# EAGLE design KIT_UNAZ (EAGLE 9.4.1)
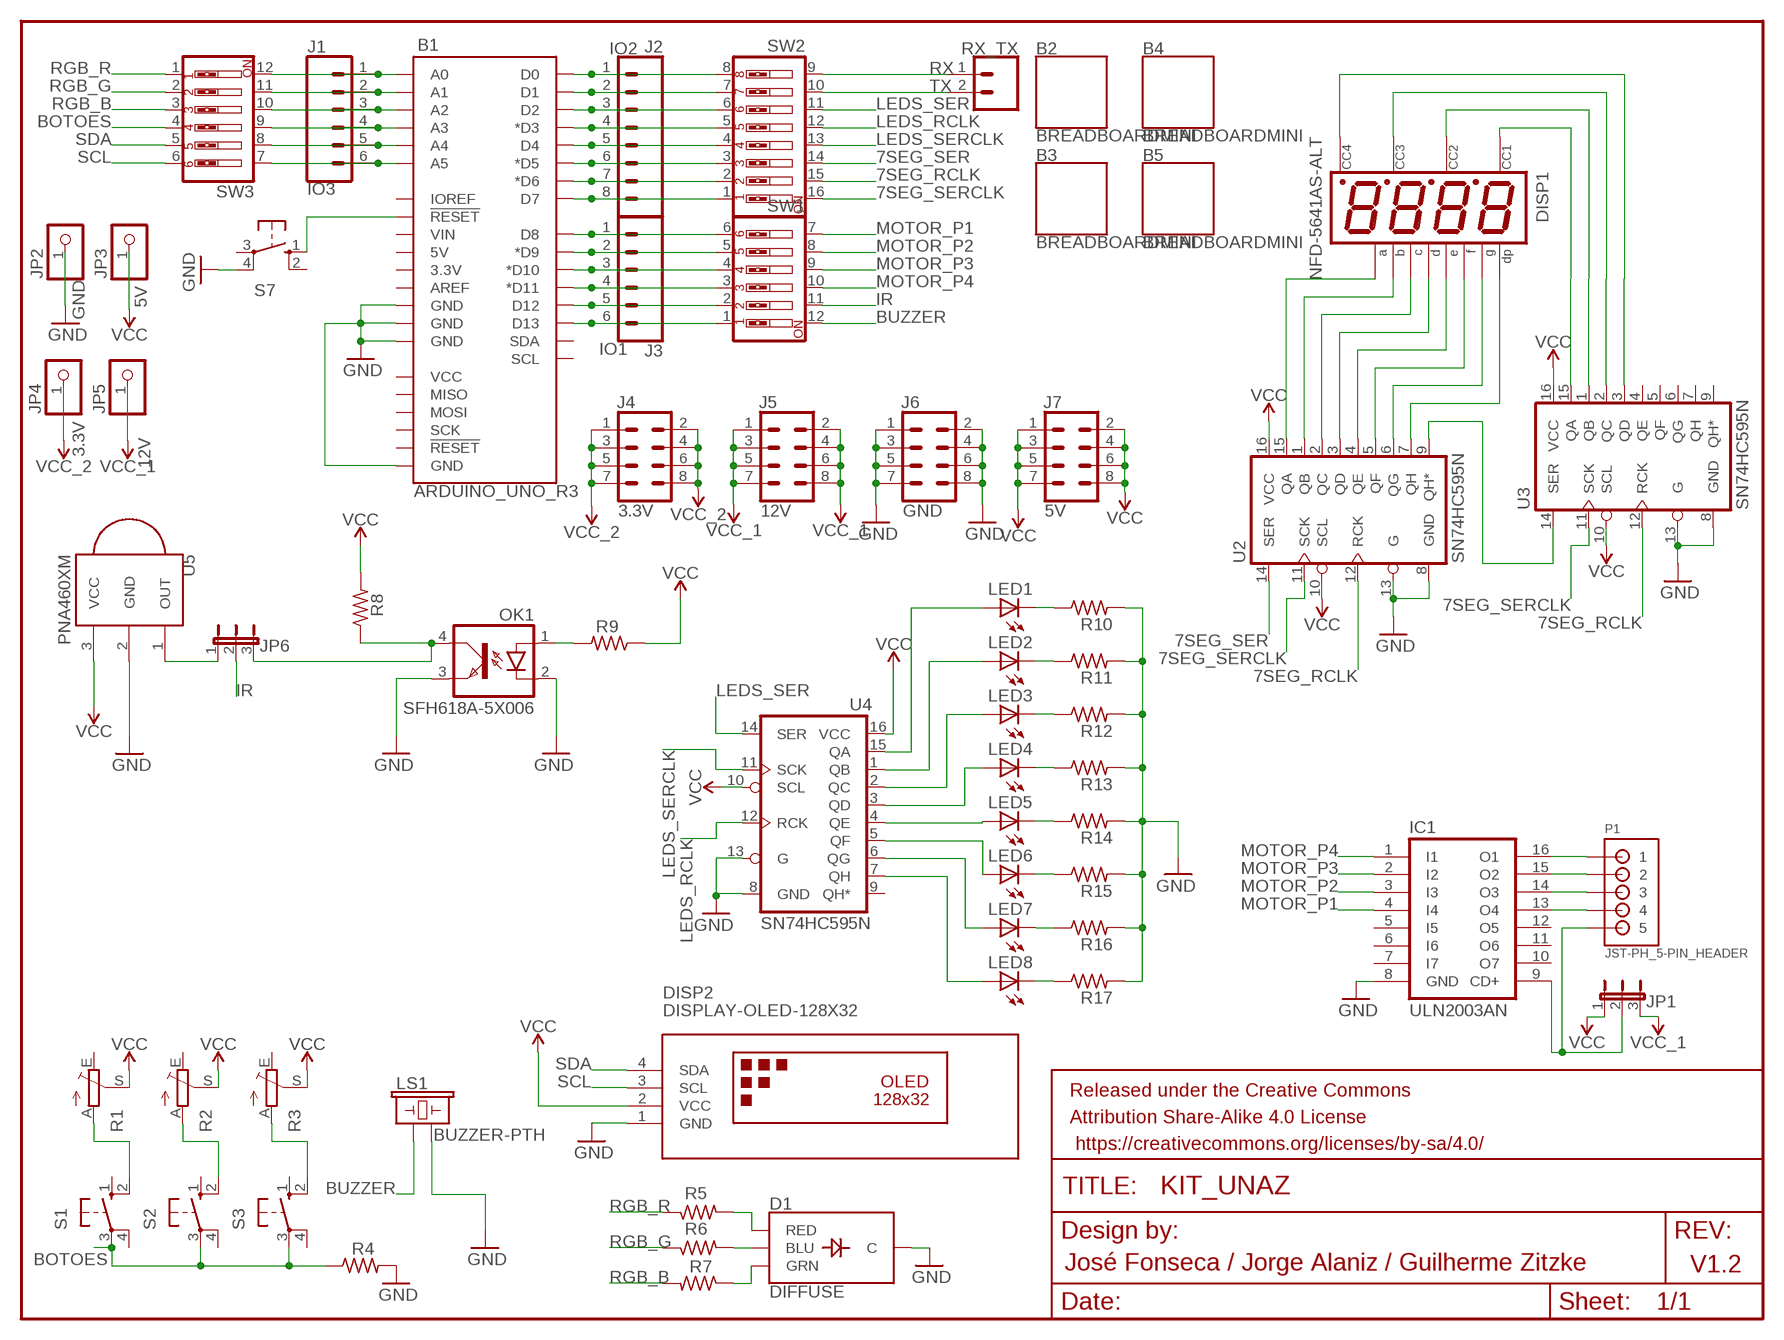
[diagram p0: schematic, sheet 1]

## Parts
B1  ARDUINO_UNO_R3  [ARDUINO_R3]
B2  BREADBOARDMINI  [BREADBOARD-MINI]
B3  BREADBOARDMINI  [BREADBOARD-MINI]
B4  BREADBOARDMINI  [BREADBOARD-MINI]
B5  BREADBOARDMINI  [BREADBOARD-MINI]
D1  DIFFUSE  LED-RGB-CCDIFFUSE  [WS2812B-PTH-KIT]
DISP1  NFD-5641AS-ALT  [NFD-5641]
DISP2  DISPLAY-OLED-128X32  [DISPLAY-OLED-128X32]
FRAME1  FRAME-LETTER  [CREATIVE_COMMONS]
IC1  ULN2003AN  [DIL16]
J1  IO3  CONN_06SILK_FEMALE_PTH  [1X06]
J2  IO2  CONN_08"  [1X08]
J3  IO1  CONN_06SILK_FEMALE_PTH  [1X06]
J4  3.3V  CONN_04X2  [2X4]
J5  12V  CONN_04X2  [2X4]
J6  GND  CONN_04X2  [2X4]
J7  5V  CONN_04X2  [2X4]
JP1  JP2E  [JP2]
JP2  GND  PINHD-1X1  [1X01]
JP3  5V  PINHD-1X1  [1X01]
JP4  3.3V  PINHD-1X1  [1X01]
JP5  12V  PINHD-1X1  [1X01]
JP6  JP2E  [JP2]
LED1  LED5MM  [LED5MM]
LED2  LED5MM  [LED5MM]
LED3  LED5MM  [LED5MM]
LED4  LED5MM  [LED5MM]
LED5  LED5MM  [LED5MM]
LED6  LED5MM  [LED5MM]
LED7  LED5MM  [LED5MM]
LED8  LED5MM  [LED5MM]
LS1  BUZZER-PTH  [BUZZER-12MM]
OK1  SFH618A-5X006  [DIP4-400]
P1  JST-PH_5-PIN_HEADER  [JST_B5B-PH_HEADER]
R1  TRIM_EU-B64Y  [B64Y]
R2  TRIM_EU-B64Y  [B64Y]
R3  TRIM_EU-B64Y  [B64Y]
R4  R-US_0204/7  [0204/7]
R5  R-US_0204/7  [0204/7]
R6  R-US_0204/7  [0204/7]
R7  R-US_0204/7  [0204/7]
R8  R-US_0204/7  [0204/7]
R9  R-US_0204/7  [0204/7]
R10  R-US_0204/7  [0204/7]
R11  R-US_0204/7  [0204/7]
R12  R-US_0204/7  [0204/7]
R13  R-US_0204/7  [0204/7]
R14  R-US_0204/7  [0204/7]
R15  R-US_0204/7  [0204/7]
R16  R-US_0204/7  [0204/7]
R17  R-US_0204/7  [0204/7]
RX_TX  CONN_02  [1X02]
S1  40-XX  [B3F-40XX]
S2  40-XX  [B3F-40XX]
S3  40-XX  [B3F-40XX]
S7  40-XX  [B3F-40XX]
SW1  SW_DIP-6  [EDG-06]
SW2  SW_DIP-8  [EDG-08]
SW3  SW_DIP-6  [EDG-06]
U2  SN74HC595N  74HC595N  [DIP16]
U3  SN74HC595N  74HC595N  [DIP16]
U4  SN74HC595N  74HC595N  [DIP16]
U5  PNA460XM  [PNA460XM]

## Nets
7SEG_RCLK: SW2.15 U2.12(RCK) U3.12(RCK)
7SEG_SER: SW2.14 U2.14(SER)
7SEG_SERCLK: SW2.16 U2.11(SCK) U3.11(SCK)
BOTOES: R4.1 S1.3(P) S2.3(P) S3.3(P) SW3.4
BUZZER: LS1.+ SW1.12
GND: B1.GND@1(GND) B1.GND@2(GND) B1.GND@3(GND) B1.GND@4(GND) D1.2(C) DISP2.1(GND) IC1.8(GND) J6.1 J6.2 J6.3 J6.4 J6.5 J6.6 J6.7 J6.8 JP2.1 LS1.- OK1.2(C) OK1.3(EMIT) R4.2 R10.2 R11.2 R12.2 R13.2 R14.2 R15.2 R16.2 R17.2 S7.4(P1) U2.8(GND) U2.13(G) U3.8(GND) U3.13(G) U4.8(GND) U4.13(G) U5.2(GND)
IR: JP6.2 SW1.11
LEDS_RCLK: SW2.12 U4.12(RCK)
LEDS_SER: SW2.11 U4.14(SER)
LEDS_SERCLK: SW2.13 U4.11(SCK)
MOTOR_P1: IC1.4(I4) SW1.7
MOTOR_P2: IC1.3(I3) SW1.8
MOTOR_P3: IC1.2(I2) SW1.9
MOTOR_P4: IC1.1(I1) SW1.10
N$1: R1.A S1.2(S1)
N$2: R2.A S2.2(S1)
N$3: R3.A S3.2(S1)
N$5: B1.A0 J1.1 SW3.12
N$6: B1.A1 J1.2 SW3.11
N$7: B1.A2 J1.3 SW3.10
N$8: B1.A3 J1.4 SW3.9
N$9: B1.A4 J1.5 SW3.8
N$10: B1.A5 J1.6 SW3.7
N$11: D1.1(RED) R5.2
N$12: D1.4(BLU) R6.2
N$13: D1.3(GRN) R7.1
N$14: DISP1.P$11 U2.15(QA)
N$15: B1.D13 J3.6 SW1.1
N$16: B1.D12 J3.5 SW1.2
N$17: LED5.K(C) R14.1
N$18: LED4.K(C) R13.1
N$19: LED1.K(C) R10.1
N$20: LED2.K(C) R11.1
N$21: LED3.K(C) R12.1
N$22: LED6.K(C) R15.1
N$23: LED1.A U4.15(QA)
N$24: LED2.A U4.1(QB)
N$25: LED3.A U4.2(QC)
N$26: LED4.A U4.3(QD)
N$27: LED5.A U4.4(QE)
N$28: LED6.A U4.5(QF)
N$29: DISP1.P$7 U2.1(QB)
N$30: DISP1.P$4 U2.2(QC)
N$31: DISP1.P$2 U2.3(QD)
N$32: DISP1.P$1 U2.4(QE)
N$33: DISP1.P$10 U2.5(QF)
N$34: DISP1.P$5 U2.6(QG)
N$35: DISP1.P$3 U2.7(QH)
N$36: U2.9(QH*) U3.14(SER)
N$37: LED7.A U4.6(QG)
N$38: LED8.A U4.7(QH)
N$39: B1.D11(*D11) J3.4 SW1.3
N$40: B1.D10(*D10) J3.3 SW1.4
N$41: B1.D9(*D9) J3.2 SW1.5
N$42: DISP1.P$12 U3.15(QA)
N$43: B1.RESET@1(!RESET!) S7.1(S)
N$44: DISP1.P$9 U3.1(QB)
N$45: DISP1.P$8 U3.2(QC)
N$46: DISP1.P$6 U3.3(QD)
N$47: IC1.16(O1) P1.P1
N$48: IC1.15(O2) P1.P2
N$49: IC1.14(O3) P1.P3
N$50: IC1.13(O4) P1.P4
N$51: IC1.9(CD+) JP1.2 P1.P5
N$52: JP6.1 U5.1(OUT)
N$53: JP6.3 OK1.4(COL) R8.1
N$54: OK1.1(A) R9.2
N$55: LED7.K(C) R16.1
N$56: LED8.K(C) R17.1
N$57: B1.D0 J2.1 SW2.8
N$58: B1.D1 J2.2 SW2.7
N$59: B1.D2 J2.3 SW2.6
N$60: B1.D3(*D3) J2.4 SW2.5
N$61: B1.D4 J2.5 SW2.4
N$62: B1.D5(*D5) J2.6 SW2.3
N$63: B1.D6(*D6) J2.7 SW2.2
N$64: B1.D8 J3.1 SW1.6
N$65: B1.D7 J2.8 SW2.1
RGB_B: R7.2 SW3.2
RGB_G: R6.1 SW3.3
RGB_R: R5.1 SW3.1
RX: RX_TX.1 SW2.9
SCL: DISP2.3(SCL) SW3.6
SDA: DISP2.4(SDA) SW3.5
TX: RX_TX.2 SW2.10
VCC: DISP2.2(VCC) J7.1 J7.2 J7.3 J7.4 J7.5 J7.6 J7.7 J7.8 JP1.1 JP3.1 R1.S R2.S R3.S R8.2 R9.1 U2.10(SCL) U2.16(VCC) U3.10(SCL) U3.16(VCC) U4.10(SCL) U4.16(VCC) U5.3(VCC)
VCC_1: J5.1 J5.2 J5.3 J5.4 J5.5 J5.6 J5.7 J5.8 JP1.3 JP5.1
VCC_2: J4.1 J4.2 J4.3 J4.4 J4.5 J4.6 J4.7 J4.8 JP4.1
Unconnected: B1.3.3V B1.5V B1.AREF B1.IOREF B1.MISO B1.MOSI B1.RESET@2(!RESET!) B1.SCK B1.SCL B1.SDA B1.VCC B1.VIN IC1.5(I5) IC1.6(I6) IC1.7(I7) IC1.10(O7) IC1.11(O6) IC1.12(O5) R1.E R2.E R3.E S1.1(S) S1.4(P1) S2.1(S) S2.4(P1) S3.1(S) S3.4(P1) S7.2(S1) S7.3(P) U3.4(QE) U3.5(QF) U3.6(QG) U3.7(QH) U3.9(QH*) U4.9(QH*)

## Notes on the sheet
- José Fonseca / Jorge Alaniz / Guilherme Zitzke | V1.2

## Library data of the parts
B1 = SparkFun-Boards:ARDUINO_UNO_R3: Arduino R3 Footprint with SPI header Arduino Uno R3 Compatible Footprint. Matches PCB size of the original board. SparkFun Products: SAMD21 Dev Breakout <https://www.sparkfun.com/products/13672> RedBoard <https://www.sparkfun.com/products/12757> R3 Stackable Headers <https://www.sparkfun.com/products/11417>
B2-B5 = SparkFun-Boards:BREADBOARD: SparkFun Breadboard Mini This is the mechnical outline for the very small self adhesive breadboard from SparkFun Electronics and our prototyping breadboard of the same size. Good for very small proto areas. SparkFun Products: White <https://www.sparkfun.com/products/7916> Green <https://www.sparkfun.com/products/12046> Black <https://www.sparkfun.com/products/12047> Red <https://www.sparkfun.com/products/12044> Blue <https://www.sparkfun.com/products/12045> SparkFun Solder-able Breadboard-Mini <https://www.sparkfun.com/products/12702>; PROD_ID: COMP-12034
D1 = SparkFun-LED:LED-RGB-CC: LED-RGB Common Cathode Packages: LED RGB-THRU LED_PIRANHA_5MM SparkFun Products: RGB Diffused Common Cathode- Diffuse <[https://www.sparkfun.com/products/9264]> RGB Diffused Common Cathode - Clear <[https://www.sparkfun.com/products/105]> LED-RGB 5mm Square (Piranha) <[https://www.sparkfun.com/products/11679]>; PROD_ID: DIO-09434
DISP1 = display-nfd:NFD-5641AS-ALT: Four Digit 0.56" CC Seven-Segment LED Display Futurlec part number: 7FR5641AS Created by RobG
DISP2 = diy-modules:DISPLAY-OLED-128X32: 128x32 Dot Matrix OLED Module with I2C interface based on SSD1306 chip More details available here: http://www.tinyosshop.com/index.php?route=product/product&product_id=953 Schematic available here: http://www.tinyosshop.com/datasheet/OLED%2012832.pdf SSD1306 datasheet: https://cdn-shop.adafruit.com/datasheets/SSD1306.pdf Click here to find device on ebay.com <http://www.ebay.com/sch/oled+display+128x32+i2c>
FRAME1 = SparkFun-Aesthetics:FRAME-LETTER: Schematic Frame - Letter Standard 8.5x11 US Letter frame
IC1 = uln-udn:ULN2003A: DRIVER ARRAY
J1 J3 = SparkFun-Connectors:CONN_06: Multi connection point. Often used as Generic Header-pin footprint for 0.1 inch spaced/style header connections On any of the 0.1 inch spaced packages, you can populate with these: Break Away Headers - Straight <https://www.sparkfun.com/products/116> (PRT-00116) Break Away Male Headers - Right Angle <https://www.sparkfun.com/products/553> (PRT-00553) Female Headers <https://www.sparkfun.com/products/115> (PRT-00115) Break Away Headers - Machine Pin <https://www.sparkfun.com/products/117> (PRT-00117) Break Away Female Headers - Swiss Machine Pin <https://www.sparkfun.com/products/743> (PRT-00743) Arduino Stackable Header - 6 Pin <https://www.sparkfun.com/products/9280> (PRT-09280) For SCREWTERMINALS and SPRING TERMINALS visit here: Screw Terimnals on SparkFun.com <https://www.sparkfun.com/search/results?term=Screw+Terminals> (5mm/3.5mm/2.54mm spacing) This device is also useful as a general connection point to wire up your design to another part of your project. Our various solder wires solder well into these plated through hole pads. Hook-Up Wire - Assortment (Stranded, 22 AWG) <https://www.sparkfun.com/products/11375> (PRT-11375) Hook-Up Wire - Assortment (Solid Core, 22 AWG) <https://www.sparkfun.com/products/11367> (PRT-11367) View the entire wire category on our website here <https://www.sparkfun.com/categories/141>; PROD_ID: CONN-08437
J2 = SparkFun-Connectors:CONN_08: Multi connection point. Often used as Generic Header-pin footprint for 0.1 inch spaced/style header connections On any of the 0.1 inch spaced packages, you can populate with these: Break Away Headers - Straight <https://www.sparkfun.com/products/116> (PRT-00116) Break Away Male Headers - Right Angle <https://www.sparkfun.com/products/553> (PRT-00553) Female Headers <https://www.sparkfun.com/products/115> (PRT-00115) Break Away Headers - Machine Pin <https://www.sparkfun.com/products/117> (PRT-00117) Break Away Female Headers - Swiss Machine Pin <https://www.sparkfun.com/products/743> (PRT-00743) Arduino Stackable Header - 8 Pin <https://www.sparkfun.com/products/9279> (PRT-09279) For SCREWTERMINALS and SPRING TERMINALS visit here: Screw Terimnals on SparkFun.com <https://www.sparkfun.com/search/results?term=Screw+Terminals> (5mm/3.5mm/2.54mm spacing) This device is also useful as a general connection point to wire up your design to another part of your project. Our various solder wires solder well into these plated through hole pads. Hook-Up Wire - Assortment (Stranded, 22 AWG) <https://www.sparkfun.com/products/11375> (PRT-11375) Hook-Up Wire - Assortment (Solid Core, 22 AWG) <https://www.sparkfun.com/products/11367> (PRT-11367) View the entire wire category on our website here <https://www.sparkfun.com/categories/141> Special notes: Molex polarized connector foot print use with SKU : PRT-08231 with associated crimp pins and housings. 1MM SMD Version SKU: PRT-10208 NOTES ON THE VARIANTS LOCK and LOCK_LONGPADS... This footprint was designed to help hold the alignment of a through-hole component (i.e. 6-pin header) while soldering it into place. You may notice that each hole has been shifted either up or down by 0.005 of an inch from it's more standard position (which is a perfectly straight line). This slight alteration caused the pins (the squares in the middle) to touch the edges of the holes. Because they are alternating, it causes a "brace" to hold the component in place. 0.005 has proven to be the perfect amount of "off-center" position when using our standard breakaway headers. Although looks a little odd when you look at the bare footprint, once you have a header in there, the alteration is very hard to notice. Also,if you push a header all the way into place, it is covered up entirely on the bottom side.; PROD_ID: CONN-08438
J4-J7 = SparkFun-Connectors:CONN_04X2: Multi connection point. Often used as Generic Header-pin footprint for 0.1 inch spaced/style header connections On any of the 0.1 inch spaced packages, you can populate with these: Break Away Headers - Straight <https://www.sparkfun.com/products/116> (PRT-00116) Break Away Male Headers - Right Angle <https://www.sparkfun.com/products/553> (PRT-00553) Female Headers <https://www.sparkfun.com/products/115> (PRT-00115) Break Away Headers - Machine Pin <https://www.sparkfun.com/products/117> (PRT-00117) Break Away Female Headers - Swiss Machine Pin <https://www.sparkfun.com/products/743> (PRT-00743)
JP1 JP6 = jumper:JP2E: JUMPER
JP2-JP5 = adafruit:PINHD-1X1: Pin header 1x1 for 0.1" spacing With round pins
LED1-LED8 = adafruit:LED: LED OSRAM: - CHIPLED LG R971, LG N971, LY N971, LG Q971, LY Q971, LO R971, LY R971 LH N974, LH R974 LS Q976, LO Q976, LY Q976 LO Q996 - Hyper CHIPLED LW Q18S LB Q993, LB Q99A, LB R99A - SideLED LS A670, LO A670, LY A670, LG A670, LP A670 LB A673, LV A673, LT A673, LW A673 LH A674 LY A675 LS A676, LA A676, LO A676, LY A676, LW A676 LS A679, LY A679, LG A679 - Hyper Micro SIDELED® LS Y876, LA Y876, LO Y876, LY Y876 LT Y87S - SmartLED LW L88C, LW L88S LB L89C, LB L89S, LG L890 LS L89K, LO L89K, LY L89K LS L896, LA L896, LO L896, LY L896 - TOPLED LS T670, LO T670, LY T670, LG T670, LP T670 LSG T670, LSP T670, LSY T670, LOP T670, LYG T670 LG T671, LOG T671, LSG T671 LB T673, LV T673, LT T673, LW T673 LH T674 LS T676, LA T676, LO T676, LY T676, LB T676, LH T676, LSB T676, LW T676 LB T67C, LV T67C, LT T67C, LS T67K, LO T67K, LY T67K, LW E67C LS E67B, LA E67B, LO E67B, LY E67B, LB E67C, LV E67C, LT E67C LW T67C LS T679, LY T679, LG T679 LS T770, LO T770, LY T770, LG T770, LP T770 LB T773, LV T773, LT T773, LW T773 LH T774 LS E675, LA E675, LY E675, LS T675 LS T776, LA T776, LO T776, LY T776, LB T776 LHGB T686 LT T68C, LB T68C - Hyper Mini TOPLED® LB M676 - Mini TOPLED Santana® LG M470 LS M47K, LO M47K, LY M47K Source: http://www.osram.convergy.de/
LS1 = SparkFun-Electromechanical:BUZZER: Buzzer Small round buzzers that operate around the audible 2kHz range. You can use these as speakers to create simple music or user interfaces. Variant Overview: PTH - Mini Speaker - PC Mount 12mm 2.048kHz <https://www.sparkfun.com/products/7950> PTH_KIT - Mini Speaker - PC Mount 12mm 2.048kHz <https://www.sparkfun.com/products/7950> KIT simplifies soldering by adding stop mask to one side of the pads. PTH_NO_SILK - Mini Speaker - PC Mount 12mm 2.048kHz <https://www.sparkfun.com/products/7950> No silkscreen indicator of buzzer outline. PTH_KIT_NO_SILK - Mini Speaker - PC Mount 12mm 2.048kHz <https://www.sparkfun.com/products/7950> KIT package w/o silkscreen SMD - Buzzer Audio Magnetic (CCV-084B16) SMD buzzer used on, e.g. the LilyPad Buzzer <https://www.sparkfun.com/products/8463> and RFID USB Reader <https://www.sparkfun.com/products/9963>. SMD_KIT - Buzzer Audio Magnetic (CCV-084B16) SMD Buzzer with elongated pins to make soldering easier. Used on the SparkFun Simon Says - Surface Mount Soldering Kit <https://www.sparkfun.com/products/10935>.; PROD_ID: COMP-08253; SF_SKU: COM-07950
OK1 = optocoupler:SFH618?*: Optocoupler, Phototransistor Output, Low Input Current Source: Data sheet <http://www.vishay.com/docs/83673/sfh618.pdf>; OC_FARNELL: unknown; OC_NEWARK: unknown
P1 = srg:JST-PH_5-PIN_HEADER: 5-pin JST PH Shrouded Header, top entry P/N B5B-PH-K-S Mating connector PHR-5 Mating cable assembly: Sparkfun PRT-09917 <http://www.sparkfun.com/products/9917>
R1-R3 = pot:TRIM_EU-: POTENTIOMETER
R4-R17 = adafruit:R-US_: RESISTOR, American symbol
RX_TX = SparkFun-Connectors:CONN_02: Multi connection point. Often used as Generic Header-pin footprint for 0.1 inch spaced/style header connections On any of the 0.1 inch spaced packages, you can populate with these: Break Away Headers - Straight <https://www.sparkfun.com/products/116> (PRT-00116) Break Away Male Headers - Right Angle <https://www.sparkfun.com/products/553> (PRT-00553) Female Headers <https://www.sparkfun.com/products/115> (PRT-00115) Break Away Headers - Machine Pin <https://www.sparkfun.com/products/117> (PRT-00117) Break Away Female Headers - Swiss Machine Pin <https://www.sparkfun.com/products/743> (PRT-00743) For SCREWTERMINALS and SPRING TERMINALS visit here: Screw Terimnals on SparkFun.com <https://www.sparkfun.com/search/results?term=Screw+Terminals> (5mm/3.5mm/2.54mm spacing) This device is also useful as a general connection point to wire up your design to another part of your project. Our various solder wires solder well into these plated through hole pads. Hook-Up Wire - Assortment (Stranded, 22 AWG) <https://www.sparkfun.com/products/11375> (PRT-11375) Hook-Up Wire - Assortment (Solid Core, 22 AWG) <https://www.sparkfun.com/products/11367> (PRT-11367) View the entire wire category on our website here <https://www.sparkfun.com/categories/141> Special notes: Molex polarized connector foot print use with: PRT-08233 with associated crimp pins and housings. 2.54_SCREWTERM for use with PRT-10571. 3.5mm Screw Terminal footprints for PRT-08084 5mm Screw Terminal footprints for use with PRT-08432
S1-S3 S7 = switch-omron:40-XX: OMRON SWITCH; MF: OMRON COMPONENTS USA; MPN: B3F-4000; OC_FARNELL: 176434; OC_NEWARK: 36K3105
SW1 SW3 = special:SW_DIP-6: DIP SWITCH
SW2 = special:SW_DIP-8: DIP SWITCH
U2-U4 = SparkFun-IC-Logic:74*595: 8-Bit Shift Register (Serial to Parallel) Datasheet <http://cdn.sparkfun.com/datasheets/BreakoutBoards/MM74HC595.pdf> SparkFun Products SparkFun Shift Register Breakout - 74HC595 <https://www.sparkfun.com/products/10680> (BOB-10680); PROD_ID: IC-13123
U5 = adafruit:PNA460XM: IR 38KHz receiver PNA4602 and related receivers http://www.ladyada.net/library/pcb/eaglelibrary.html

## Net classes
0 default: width 0.406 mm, drill 0.45 mm, clearance 0.406 mm

## Board
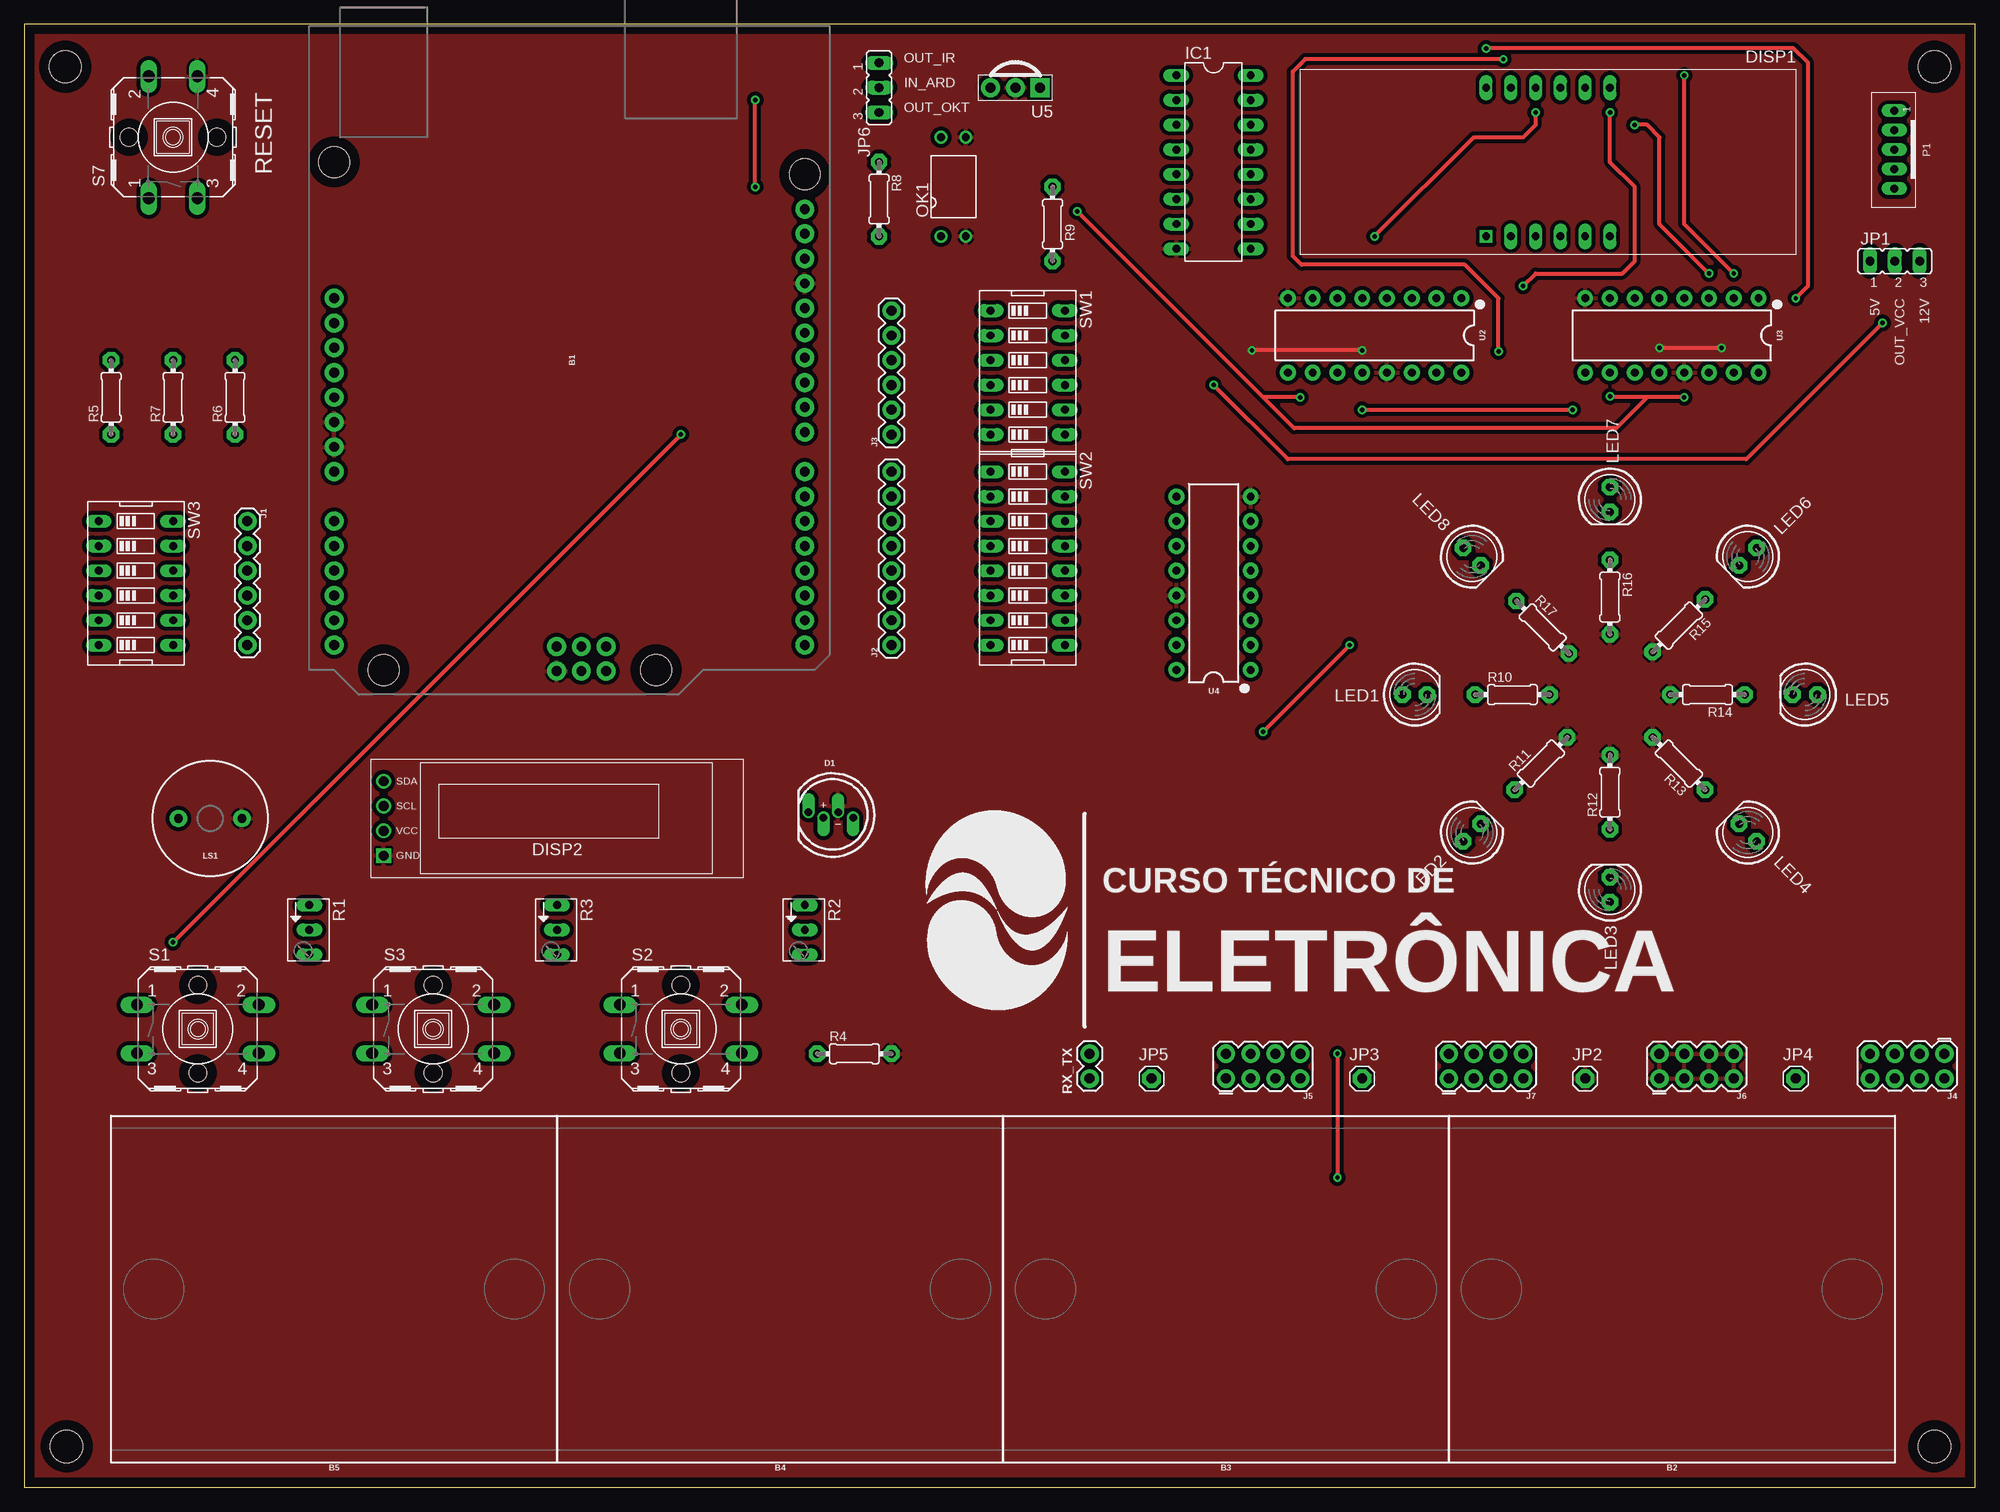
[diagram p1: board, top side]
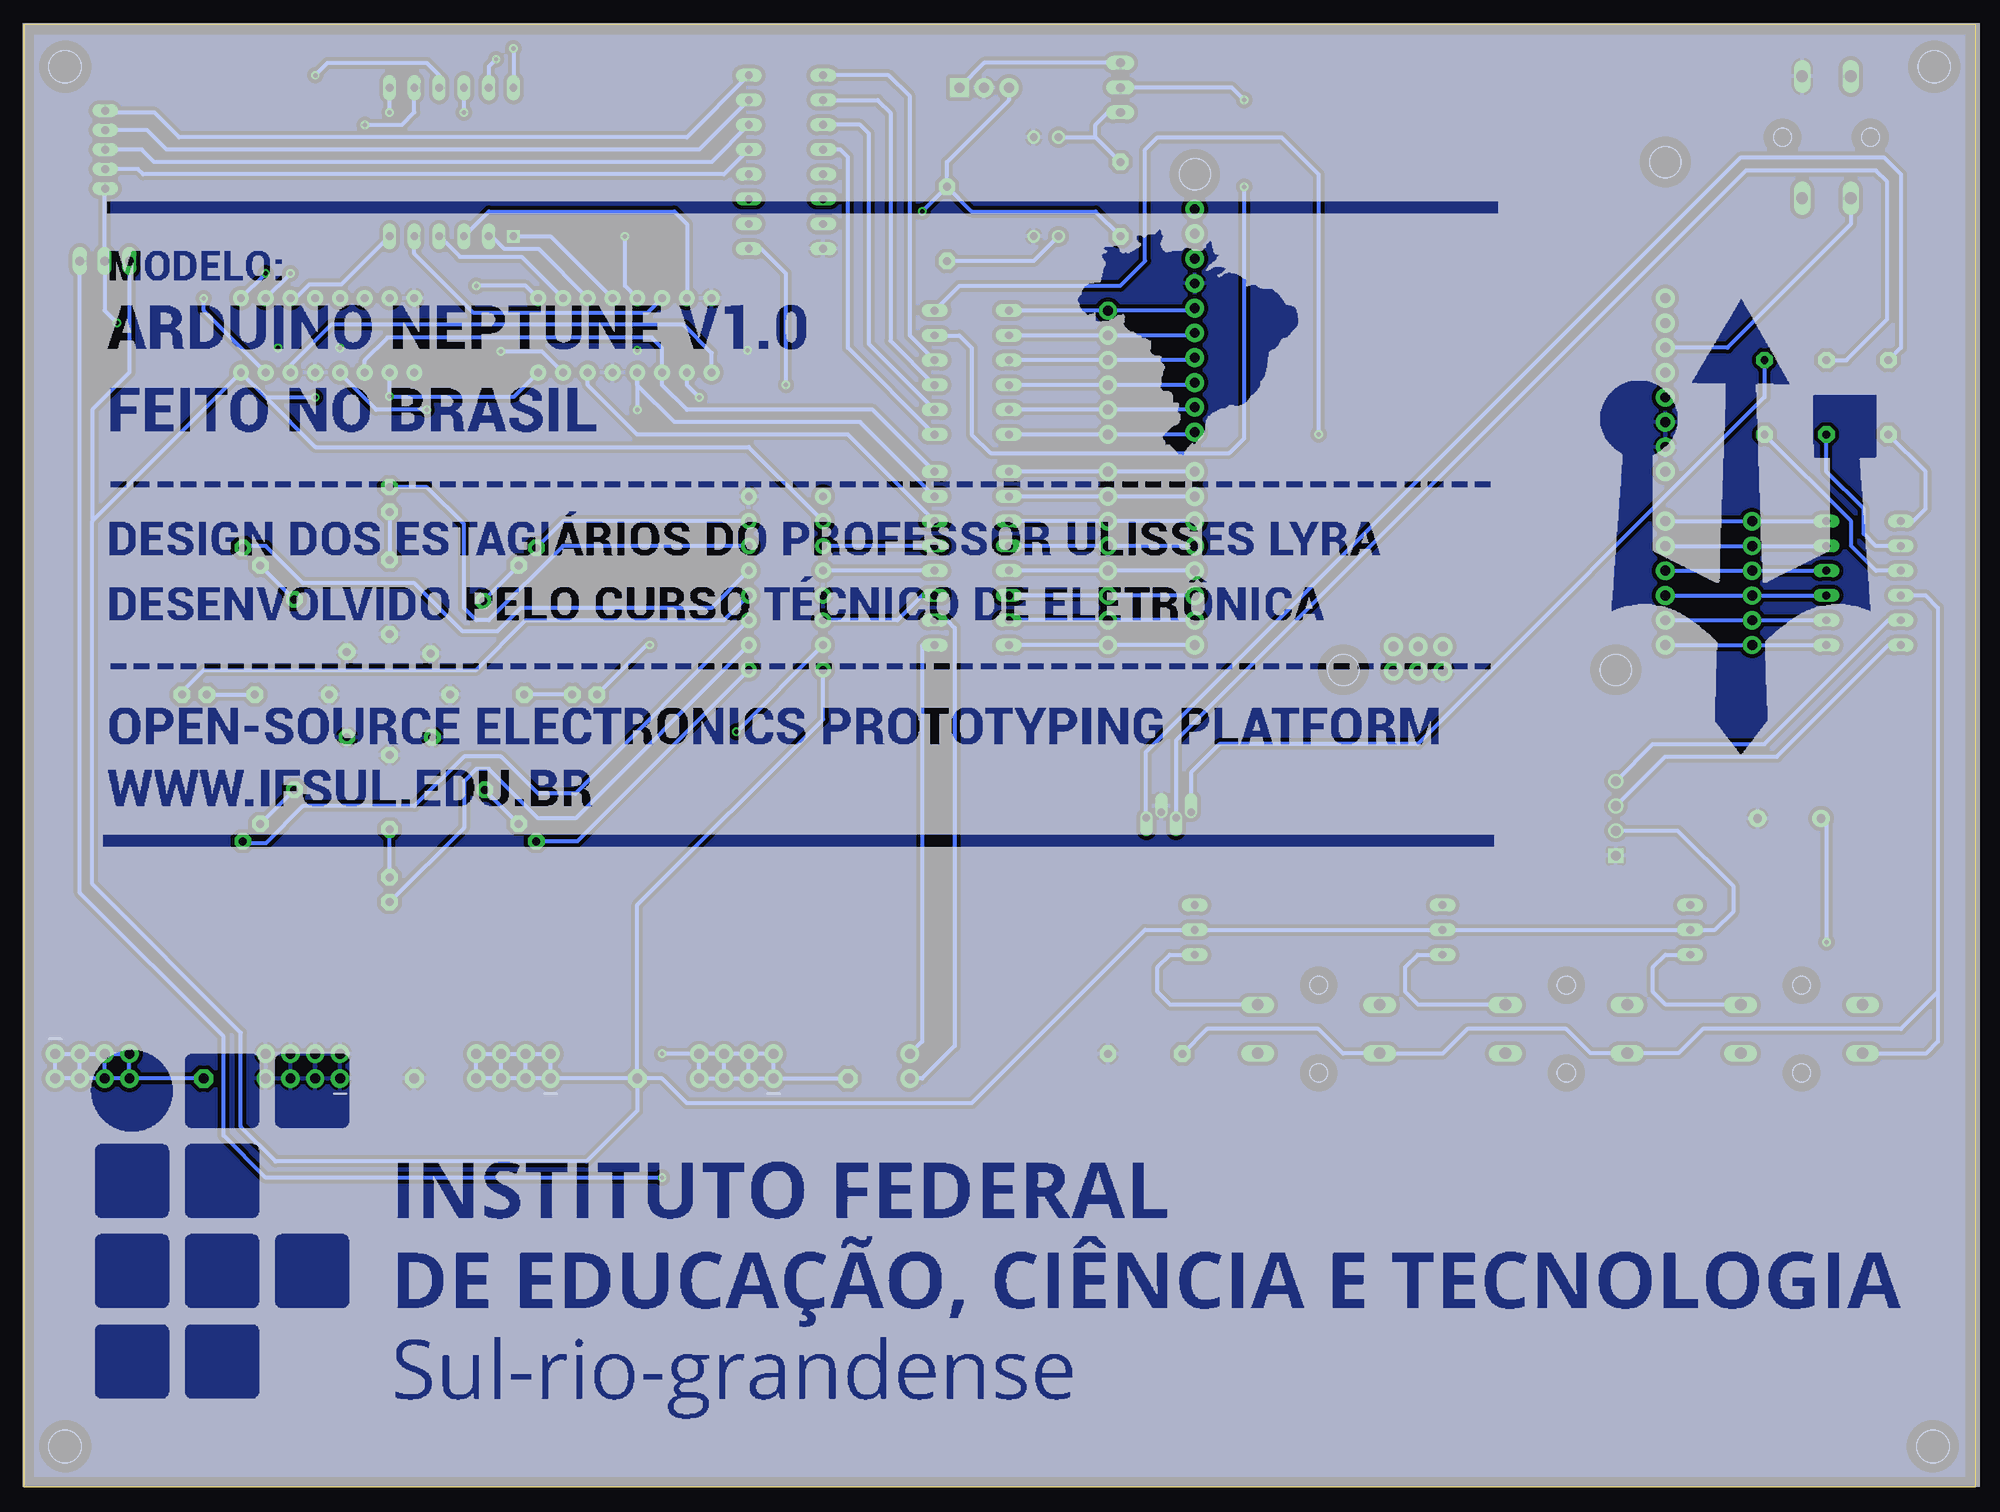
[diagram p2: board, bottom side, seen from below]

Size 200 x 150 mm. Coordinates in mm from the lower left corner, seen from the top.
Outline: 0,0 200,0 200,150 0,150 0,0
Copper layers (1*16): Top 0.035mm / dielectric 1.5mm / Bottom 0.035mm
Design rules "default *": minimum track width 6mil, minimum drill 0.35mm, track to track 6mil, track to pad 6mil, pad to pad 6mil, via to via 6mil, smd to smd 6mil, copper to edge 40mil, drill to drill 6mil, minimum pad ring 10mil, minimum via ring 8mil, stop-mask expansion 4mil, vias tented up to drill 0mil, thermal gap 10mil
Holes 3.3 mm at 195.83,4.19 4.32,4.19 195.83,145.67 4.19,145.67

### Footprints (pad centres in the part's own frame; a part is rotated, then mirrored left to right if it is on the bottom)
ARDUINO_R3 = drill 1.016 pad 1.93: 3.3V 2.54,-24.13; 5V 5.08,-24.13; A0 17.78,-24.13; A1 20.32,-24.13; A2 22.86,-24.13; A3 25.4,-24.13; A4 27.94,-24.13; A5 30.48,-24.13; AREF -9.144,24.13; D0 30.48,24.13; D1 27.94,24.13; D2 25.4,24.13; D3 22.86,24.13; D4 20.32,24.13; D5 17.78,24.13; D6 15.24,24.13; D7 12.7,24.13; D8 8.636,24.13; D9 6.096,24.13; D10 3.556,24.13; D11 1.016,24.13; D12 -1.524,24.13; D13 -4.064,24.13; GND@1 7.62,-24.13; GND@2 10.16,-24.13; GND@3 -6.604,24.13; GND@4 33.16,-1.32; IOREF -2.54,-24.13; MISO 30.62,3.76; MOSI 33.16,1.22; NC -5.08,-24.13; RESET@1 0,-24.13; RESET@2 30.62,-1.32; SCK 30.62,1.22; SCL -14.224,24.13; SDA -11.684,24.13; VCC 33.16,3.76; VIN 12.7,-24.13 | hole 3.175: -17.78,24.13; 33.02,8.89; 33.02,-19.05; -19.05,-24.13
WS2812B-PTH-KIT = drill 0.762 pad 1.27 offset: 1 2.413,0.079; 2 0.889,0.651; 3 -0.635,0.079; 4 -2.159,0.651
NFD-5641 = drill 0.8 square: P$1 -6.35,-7.62 | drill 0.8 long: P$2 -3.81,-7.62; P$3 -1.27,-7.62; P$4 1.27,-7.62; P$5 3.81,-7.62; P$6 6.35,-7.62; P$7 6.35,7.62; P$8 3.81,7.62; P$9 1.27,7.62; P$10 -1.27,7.62; P$11 -3.81,7.62; P$12 -6.35,7.62
DISPLAY-OLED-128X32 = drill 1 square: 1 -17.78,-3.81 | drill 1: 2 -17.78,-1.27; 3 -17.78,1.27; 4 -17.78,3.81
DIL16 = drill 0.813 long: 1 -8.89,-3.81; 2 -6.35,-3.81; 3 -3.81,-3.81; 4 -1.27,-3.81; 5 1.27,-3.81; 6 3.81,-3.81; 7 6.35,-3.81; 8 8.89,-3.81; 9 8.89,3.81; 10 6.35,3.81; 11 3.81,3.81; 12 1.27,3.81; 13 -1.27,3.81; 14 -3.81,3.81; 15 -6.35,3.81; 16 -8.89,3.81
1X06 = drill 1.016 pad 1.88: 1 0,0; 2 2.54,0; 3 5.08,0; 4 7.62,0; 5 10.16,0; 6 12.7,0
1X08 = drill 1.016 pad 1.88: 1 0,0; 2 2.54,0; 3 5.08,0; 4 7.62,0; 5 10.16,0; 6 12.7,0; 7 15.24,0; 8 17.78,0
2X4 = drill 1.016 pad 1.88: 1 -3.81,-1.27; 2 -3.81,1.27; 3 -1.27,-1.27; 4 -1.27,1.27; 5 1.27,-1.27; 6 1.27,1.27; 7 3.81,-1.27; 8 3.81,1.27
JP2 = drill 0.914 long: 1 -2.54,0; 2 0,0; 3 2.54,0
1X01 = drill 1.016 pad 1.93 octagon: 1 0,0
LED5MM = drill 0.813 pad 1.676 octagon: A -1.27,0; K 1.27,0
BUZZER-12MM = drill 0.9 pad 1.778: + 3.25,0; - -3.25,0
DIP4-400 = drill 0.8: 1 -1.27,-5.08; 2 1.27,-5.08; 3 1.27,5.08; 4 -1.27,5.08
JST_B5B-PH_HEADER = drill 0.8 long: P1 4,0.048; P2 2,0.048; P3 0,0.048; P4 -2,0.048; P5 -4,0.048
B64Y = drill 0.813 long: A 2.54,0; E -2.54,0; S 0,0
0204/7 = drill 0.813 pad 1.676 octagon: 1 -3.81,0; 2 3.81,0
1X02 = drill 1.016 pad 1.88: 1 0,0; 2 2.54,0
B3F-40XX = drill 1.194 long: 1 -6.248,2.489; 2 6.248,2.489; 3 -6.248,-2.489; 4 6.248,-2.489 | hole 1.803: 0,-4.496; 0,4.496
EDG-06 = drill 0.813 long: 1 -6.35,-3.81; 2 -3.81,-3.81; 3 -1.27,-3.81; 4 1.27,-3.81; 5 3.81,-3.81; 6 6.35,-3.81; 7 6.35,3.81; 8 3.81,3.81; 9 1.27,3.81; 10 -1.27,3.81; 11 -3.81,3.81; 12 -6.35,3.81
EDG-08 = drill 0.813 long: 1 -8.89,-3.81; 2 -6.35,-3.81; 3 -3.81,-3.81; 4 -1.27,-3.81; 5 1.27,-3.81; 6 3.81,-3.81; 7 6.35,-3.81; 8 8.89,-3.81; 9 8.89,3.81; 10 6.35,3.81; 11 3.81,3.81; 12 1.27,3.81; 13 -1.27,3.81; 14 -3.81,3.81; 15 -6.35,3.81; 16 -8.89,3.81
DIP16 = drill 0.813 pad 1.626: 1 -8.89,-3.81; 2 -6.35,-3.81; 3 -3.81,-3.81; 4 -1.27,-3.81; 5 1.27,-3.81; 6 3.81,-3.81; 7 6.35,-3.81; 8 8.89,-3.81; 9 8.89,3.81; 10 6.35,3.81; 11 3.81,3.81; 12 1.27,3.81; 13 -1.27,3.81; 14 -3.81,3.81; 15 -6.35,3.81; 16 -8.89,3.81
PNA460XM = drill 1.016 pad 1.93 square: 1 -2.54,0 | drill 1.016 pad 1.93: 2 0,0; 3 2.54,0

### Placement (x,y rotation side)
B1  55.88,116.84 270 top
B2  168.91,20.32 180 top
B3  123.19,20.32 180 top
B4  77.47,20.32 180 top
B5  31.75,20.32 180 top
D1  82.55,68.58 0 top
DISP1  156.21,135.89 0 top
DISP2  54.61,68.58 0 top
FRAME1  22.86,161.29 0 top  (outside the outline)
IC1  121.92,135.89 270 top
J1  22.86,99.06 270 top
J2  88.9,86.36 90 top
J3  88.9,107.95 90 top
J4  193.04,43.18 180 top
J5  127,43.18 0 top
J6  171.45,43.18 0 top
J7  149.86,43.18 0 top
JP1  191.77,125.73 0 top
JP2  160.02,41.91 180 top
JP3  137.16,41.91 180 top
JP4  181.61,41.91 0 top
JP5  115.57,41.91 180 top
JP6  87.63,143.51 270 top
LED1  142.56,81.28 0 top
LED2  148.42,67.14 45 top
LED3  162.56,61.28 90 top
LED4  176.7,67.14 135 top
LED5  182.56,81.28 180 top
LED6  176.7,95.42 225 top
LED7  162.56,101.28 270 top
LED8  148.42,95.42 315 top
LS1  19.05,68.58 180 top
OK1  95.25,133.35 0 top
P1  191.77,137.16 90 top
R1  29.21,57.15 270 top
R2  80.01,57.15 270 top
R3  54.61,57.15 270 top
R4  85.09,44.45 0 top
R5  8.89,111.76 90 top
R6  21.59,111.76 90 top
R7  15.24,111.76 270 top
R8  87.63,132.08 270 top
R9  105.41,129.54 270 top
R10  152.56,81.28 0 top
R11  155.49,74.21 45 top
R12  162.56,71.28 90 top
R13  169.63,74.21 135 top
R14  172.56,81.28 180 top
R15  169.63,88.35 225 top
R16  162.56,91.28 270 top
R17  155.66,88.18 315 top
RX_TX  109.22,44.45 270 top
S1  17.78,46.99 0 top
S2  67.31,46.99 0 top
S3  41.91,46.99 0 top
S7  15.24,138.43 90 top
SW1  102.87,114.3 270 top
SW2  102.87,95.25 270 top
SW3  11.43,92.71 270 top
U2  138.43,118.11 180 top
U3  168.91,118.11 180 top
U4  121.92,92.71 90 top
U5  101.6,143.51 180 top

### Tracks (layer width: path | path; a pad name or v marks a point on that pad's centre or on a via)
7SEG_RCLK  (via drill 0.45)
  Top 0.406: v137.16,110.49 138.43,110.49 | 138.43,110.49 v158.75,110.49 | 138.43,110.49
  Bottom 0.406: SW2.15 114.3,109.22 133.35,109.22 137.16,113.03 U2.12 v137.16,110.49 | v158.75,110.49 163.96,110.49 167.64,114.17 U3.12
7SEG_SER
  Bottom 0.406: SW2.14 115.57,107.95 137.16,107.95 142.24,113.03 U2.14
7SEG_SERCLK
  Bottom 0.406: SW2.16 113.03,110.49 132.08,110.49 134.62,113.03 U2.11 134.62,116.82 135.68,117.88 162.77,117.88 165.1,115.55 U3.11
BOTOES
  Bottom 0.406: SW3.4 5.08,91.44 3.81,90.17 3.81,50.8 | 3.81,50.8 7.62,46.99 27.94,46.99 30.43,44.5 S3.3 39.42,44.5 41.91,46.99 52.07,46.99 54.61,44.45 61.01,44.45 S2.3 64.72,44.5 64.77,44.45 67.31,46.99 78.74,46.99 R4.1 | 3.81,50.8 3.81,45.72 5.08,44.45 11.48,44.45 S1.3
BUZZER  (via drill 0.45)
  Top 0.406: v67.31,107.95 v15.24,55.88
  Bottom 0.406: SW1.12 104.14,123.19 87.63,123.19 85.09,125.73 85.09,137.16 83.82,138.43 71.12,138.43 67.31,134.62 v67.31,107.95 | LS1.+ 15.24,68.02 v15.24,55.88
GND  (via drill 0.45)
  Top 0.406: v167.64,116.84 v173.99,116.84 | v137.16,116.59 v125.86,116.59
  pour Bottom (isolate 0.406): -1.27,-1.27 201.93,-1.27 201.93,151.13 -1.27,151.13
  pour Top (isolate 0.406, rank 2): -2.54,-2.54 -2.54,152.4 203.2,152.4 203.2,-2.54
IR  (via drill 0.45)
  Top 0.406: v74.93,133.35 v74.93,142.24
  Bottom 0.406: SW1.11 104.14,118.11 102.87,116.84 102.87,107.95 100.97,106.05 76.45,106.05 74.93,107.57 v74.93,133.35 | v74.93,142.24 76.2,143.51 JP6.2
LEDS_RCLK
  Bottom 0.406: SW2.12 U4.12
LEDS_SER
  Bottom 0.406: U4.14 110.49,88.9 107.95,91.44 SW2.11
LEDS_SERCLK
  Bottom 0.406: SW2.13 U4.11
MOTOR_P1
  Bottom 0.406: IC1.4 116.33,137.16 115.57,136.4 115.57,116.84 SW1.7
MOTOR_P2
  Bottom 0.406: SW1.8 113.41,117.22 113.41,138.81 114.3,139.7 IC1.3
MOTOR_P3
  Bottom 0.406: IC1.2 112.52,142.24 111.21,140.93 111.21,117.56 SW1.9
MOTOR_P4
  Bottom 0.406: SW1.10 109.22,118.11 109.22,142.62 111.38,144.78 IC1.1
N$1
  Bottom 0.406: S1.2 31.7,49.48 33.02,50.8 33.02,53.34 31.75,54.61 R1.A
N$2
  Bottom 0.406: S2.2 82.5,49.48 83.82,50.8 83.82,53.34 82.55,54.61 R2.A
N$3
  Bottom 0.406: R3.A 57.15,54.61 58.42,53.34 58.42,50.8 57.1,49.48 S3.2
N$5
  Bottom 0.406: B1.A0 J1.1 SW3.12
N$6
  Bottom 0.406: B1.A1 J1.2 SW3.11
N$7
  Bottom 0.406: B1.A2 J1.3 SW3.10
N$8
  Bottom 0.406: B1.A3 J1.4 SW3.9
N$9
  Bottom 0.406: B1.A4 J1.5 SW3.8
N$10
  Bottom 0.406: B1.A5 J1.6 SW3.7
N$11
  Bottom 0.406: R5.2 7.62,116.84 7.62,134.62 9.31,136.31 24.1,136.31 85.04,75.36 85.04,68.58 D1.1
N$12
  Bottom 0.406: R6.2 21.59,111.76 57.15,76.2 77.47,76.2 80.39,73.28 D1.4
N$13
  Bottom 0.406: R7.1 13.21,115.57 9.02,119.76 9.02,133.86 10.16,135 23.5,135 81.92,76.58 D1.3
N$14  (via drill 0.45)
  Top 0.406: v151.13,116.46 151.13,121.92 147.7,125.35 130.94,125.35 130.05,126.24 130.05,145.16 131.32,146.43 v151.64,146.43
  Bottom 0.406: U2.15 146.94,116.46 v151.13,116.46 | v151.64,146.43 152.4,145.67 DISP1.P$11
N$15
  Bottom 0.406: B1.D13 80.26,120.65 J3.6 SW1.1
N$16
  Bottom 0.406: B1.D12 80.26,118.11 J3.5 SW1.2
N$17
  Bottom 0.406: LED5.K R14.1
N$18
  Bottom 0.406: LED4.K 172.72,71.12 | 172.72,71.12 | 172.72,71.12 R13.1 | R13.1
N$19
  Bottom 0.406: LED1.K R10.1
N$20
  Bottom 0.406: LED2.K R11.1
N$21
  Bottom 0.406: LED3.K R12.1
N$22
  Bottom 0.406: LED6.K R15.1
N$23  (via drill 0.45)
  Top 0.406: v135.89,86.36 v127,77.47
  Bottom 0.406: U4.15 v127,77.47 | v135.89,86.36 136.21,86.36 LED1.A
N$24
  Bottom 0.406: U4.1 143.31,66.24 LED2.A
N$25
  Bottom 0.406: U4.2 143.51,68.58 147.32,68.58 152.4,73.66 153.67,73.66 154.94,72.39 154.94,67.63 LED3.A
N$26
  Bottom 0.406: U4.3 143.51,71.12 147.32,71.12 151.13,74.93 154.94,74.93 160.02,69.85 171.45,69.85 175.26,66.04 177.4,66.04 LED4.A
N$27
  Bottom 0.406: U4.4 128.27,88.9 148.59,88.9 153.67,83.82 181.61,83.82 183.83,81.6 LED5.A
N$28
  Bottom 0.406: LED6.A 177.4,96.52 175.26,96.52 171.45,92.71 160.02,92.71 155.07,87.76 151.51,87.76 149.1,90.17 129.54,90.17 U4.5
N$29  (via drill 0.45)
  Top 0.406: v153.67,123.19 154.94,124.46 163.83,124.46 165.1,125.73 165.1,133.35 162.56,135.89 v162.56,140.97
  Bottom 0.406: U2.1 148.59,123.19 v153.67,123.19 | v162.56,140.97 DISP1.P$7
N$30
  Bottom 0.406: U2.2 149.03,126.17 155.34,126.17 157.44,128.27 DISP1.P$4
N$31
  Bottom 0.406: DISP1.P$2 152.08,128.27 150.79,126.98 147.3,126.98 U2.3
N$32
  Bottom 0.406: DISP1.P$1 146.05,128.27 U2.4
N$33  (via drill 0.45)
  Top 0.406: v138.43,128.27 148.59,138.43 153.67,138.43 154.94,139.7 v154.94,140.97
  Bottom 0.406: U2.5 138.43,123.19 v138.43,128.27 | v154.94,140.97 DISP1.P$10
N$34
  Bottom 0.406: U2.6 136.14,120.4 153.92,120.4 160.02,126.49 DISP1.P$5
N$35
  Bottom 0.406: DISP1.P$3 152.4,130.81 133.35,130.81 132.08,129.54 U2.7
N$36
  Bottom 0.406: U2.9 129.54,116.31 132.43,119.2 168.56,119.2 172.72,115.04 U3.14
N$37
  Bottom 0.406: U4.6 144.78,96.52 152.4,88.9 153.67,88.9 154.94,90.17 154.94,98.74 158.75,102.55 LED7.A
N$38
  Bottom 0.406: U4.7 144.78,99.06 LED8.A
N$39
  Bottom 0.406: B1.D11 80.26,115.57 J3.4 SW1.3
N$40
  Bottom 0.406: B1.D10 80.26,113.03 J3.3 SW1.4
N$41
  Bottom 0.406: B1.D9 80.26,110.49 J3.2 SW1.5
N$42  (via drill 0.45)
  Top 0.406: v181.61,121.92 182.88,123.19 182.88,146.05 181.36,147.57 149.86,147.57 v149.86,147.54
  Bottom 0.406: U3.15 181.61,120.65 v181.61,121.92 | v149.86,147.54 DISP1.P$12
N$43
  Bottom 0.406: B1.RESET@1 25.4,116.84 12.75,129.49 S7.1
N$44  (via drill 0.45)
  Top 0.406: v175.26,124.46 170.18,129.54 v170.18,144.78
  Bottom 0.406: U3.1 v175.26,124.46 | v170.18,144.78 168.91,146.05 158.75,146.05 157.48,144.78 DISP1.P$9
N$45  (via drill 0.45)
  Top 0.406: v172.72,124.46 167.64,129.54 167.64,138.43 166.37,139.7 v165.1,139.7
  Bottom 0.406: U3.2 v172.72,124.46 | v165.1,139.7 161.29,139.7 160.02,140.97 DISP1.P$8
N$46
  Bottom 0.406: DISP1.P$6 167.49,123.34 170.77,123.34 172.19,121.92 U3.3
N$47
  Bottom 0.406: IC1.16 132.08,138.43 184.15,138.43 186.69,140.97 191.53,140.97 P1.P1
N$48
  Bottom 0.406: IC1.15 130.81,137.16 185.42,137.16 187.42,139.16 P1.P2
N$49
  Bottom 0.406: IC1.14 129.54,135.89 186.69,135.89 187.96,137.16 P1.P3
N$50
  Bottom 0.406: IC1.13 128.27,134.62 187.83,134.62 188.37,135.16 P1.P4
N$51  (via drill 0.45)
  Top 0.406: v190.5,119.38 176.53,105.41 129.54,105.41 v121.92,113.03
  Bottom 0.406: P1.P5 191.77,133.16 JP1.2 191.77,120.65 v190.5,119.38 | v121.92,113.03 121.92,124.46 124.46,127 IC1.9
N$52
  Bottom 0.406: JP6.1 101.6,146.05 U5.1
N$53
  Bottom 0.406: OK1.4 90.17,138.43 | JP6.3 88.9,140.97 90.17,139.7 90.17,138.43 | R8.1 90.17,138.43
N$54
  Bottom 0.406: OK1.1 96.52,125.73 R9.2
N$55
  Bottom 0.406: LED7.K R16.1
N$56
  Bottom 0.406: LED8.K R17.1
N$57
  Bottom 0.406: B1.D0 J2.1 SW2.8
N$58
  Bottom 0.406: B1.D1 J2.2 SW2.7
N$59
  Bottom 0.406: B1.D2 J2.3 SW2.6
N$60
  Bottom 0.406: B1.D3 J2.4 SW2.5
N$61
  Bottom 0.406: B1.D4 J2.5 SW2.4
N$62
  Bottom 0.406: B1.D5 J2.6 SW2.3
N$63
  Bottom 0.406: B1.D6 J2.7 SW2.2
N$64
  Bottom 0.406: B1.D8 80.26,107.95 J3.1 SW1.6
N$65
  Bottom 0.406: B1.D7 J2.8 SW2.1
RGB_B
  Bottom 0.406: SW3.2 10.16,96.52 11.43,97.79 11.43,100.33 15.24,104.14 R7.2
RGB_G
  Bottom 0.406: SW3.3 10.16,93.98 12.7,96.52 12.7,99.06 R6.1
RGB_R
  Bottom 0.406: SW3.1 6.35,99.06 5.08,100.33 5.08,104.14 R5.1
RX
  Bottom 0.406: RX_TX.1 107.95,45.72 107.95,86.36 SW2.9
SCL
  Bottom 0.406: SW3.6 8.89,86.36 20.32,74.93 31.75,74.93 DISP2.3
SDA
  Bottom 0.406: SW3.5 8.89,88.9 21.59,76.2 33.02,76.2 DISP2.4
TX
  Bottom 0.406: RX_TX.2 107.95,41.91 104.62,45.24 104.62,88.11 105.41,88.9 SW2.10
VCC  (via drill 0.45)
  Top 0.406: v170.18,111.76 166.37,111.76 | 166.37,111.76 162.56,111.76 v162.56,111.85 | v130.81,111.76 127,111.76 | 127,111.76 v107.95,130.81 | 166.37,111.76 163.19,108.58 130.18,108.58 127,111.76
  Bottom 0.406: JP3.1 J7.1 | J7.1 J7.3 | J7.3 J7.5 | J7.5 J7.7 J7.8 J7.6 | J7.6 J7.4 | J7.4 J7.2 J7.1 | J7.5 J7.6 | J7.3 J7.4 | U4.16 118.11,78.74 137.16,59.69 JP3.1 | JP3.1 134.62,41.91 132.08,39.37 102.87,39.37 85.09,57.15 R2.S R3.S R1.S 26.67,57.15 24.77,59.05 24.77,61.59 30.48,67.31 DISP2.2 | R8.2 90.17,130.81 102.87,130.81 R9.1 | R9.1 105.41,135.89 99.06,142.24 U5.3 | JP3.1 137.16,38.61 142.37,33.4 174.24,33.4 177.8,36.96 177.8,46.61 193.04,61.85 193.04,99.06 | 193.04,99.06 U3.16 175.26,111.76 | 175.26,111.76 v170.18,111.76 | U3.10 v162.56,111.85 149.77,111.85 U2.16 | v130.81,111.76 132.08,113.03 U2.10 | v107.95,130.81 R9.1 | 175.26,111.76 170.18,106.68 125.73,106.68 U4.10 | JP1.1 189.23,114.3 193.04,110.49 193.04,99.06
VCC_1  (via drill 0.45)
  Top 0.406: v134.62,44.45 v134.62,31.75
  Bottom 0.406: J5.4 J5.2 J5.1 | J5.4 J5.6 | J5.6 J5.8 | J5.1 J5.7 J5.8 | J5.1 JP5.1 | J5.5 J5.6 | J5.3 J5.4 | J5.8 v134.62,44.45 | v134.62,31.75 175.26,31.75 179.58,36.07 179.58,46.23 194.31,60.96 JP1.3
VCC_2
  Bottom 0.406: JP4.1 J4.8 | J4.8 J4.6 | J4.6 J4.4 | J4.4 J4.2 J4.1 J4.3 | J4.3 J4.5 | J4.5 J4.7 J4.8 | J4.6 J4.5 | J4.4 J4.3

### Text on the board
tPlace: CURSO TÉCNICO DE | ELETRÔNICA
tNames: OUT_IR | IN_ARD | OUT_OKT | RESET | 5V | OUT_VCC | 12V
tDocu: José Eduardo/Jorge Alaniz/Guilherme Ziztke
200bmp: E:/Users/Administrador/Desktop/LOGOFINAL.bmp | E:/Users/Administrador/Desktop/Rectangle 1.bmp